# EAGLE design rekick007 (EAGLE 4.16)

## Sheet 1 of 2
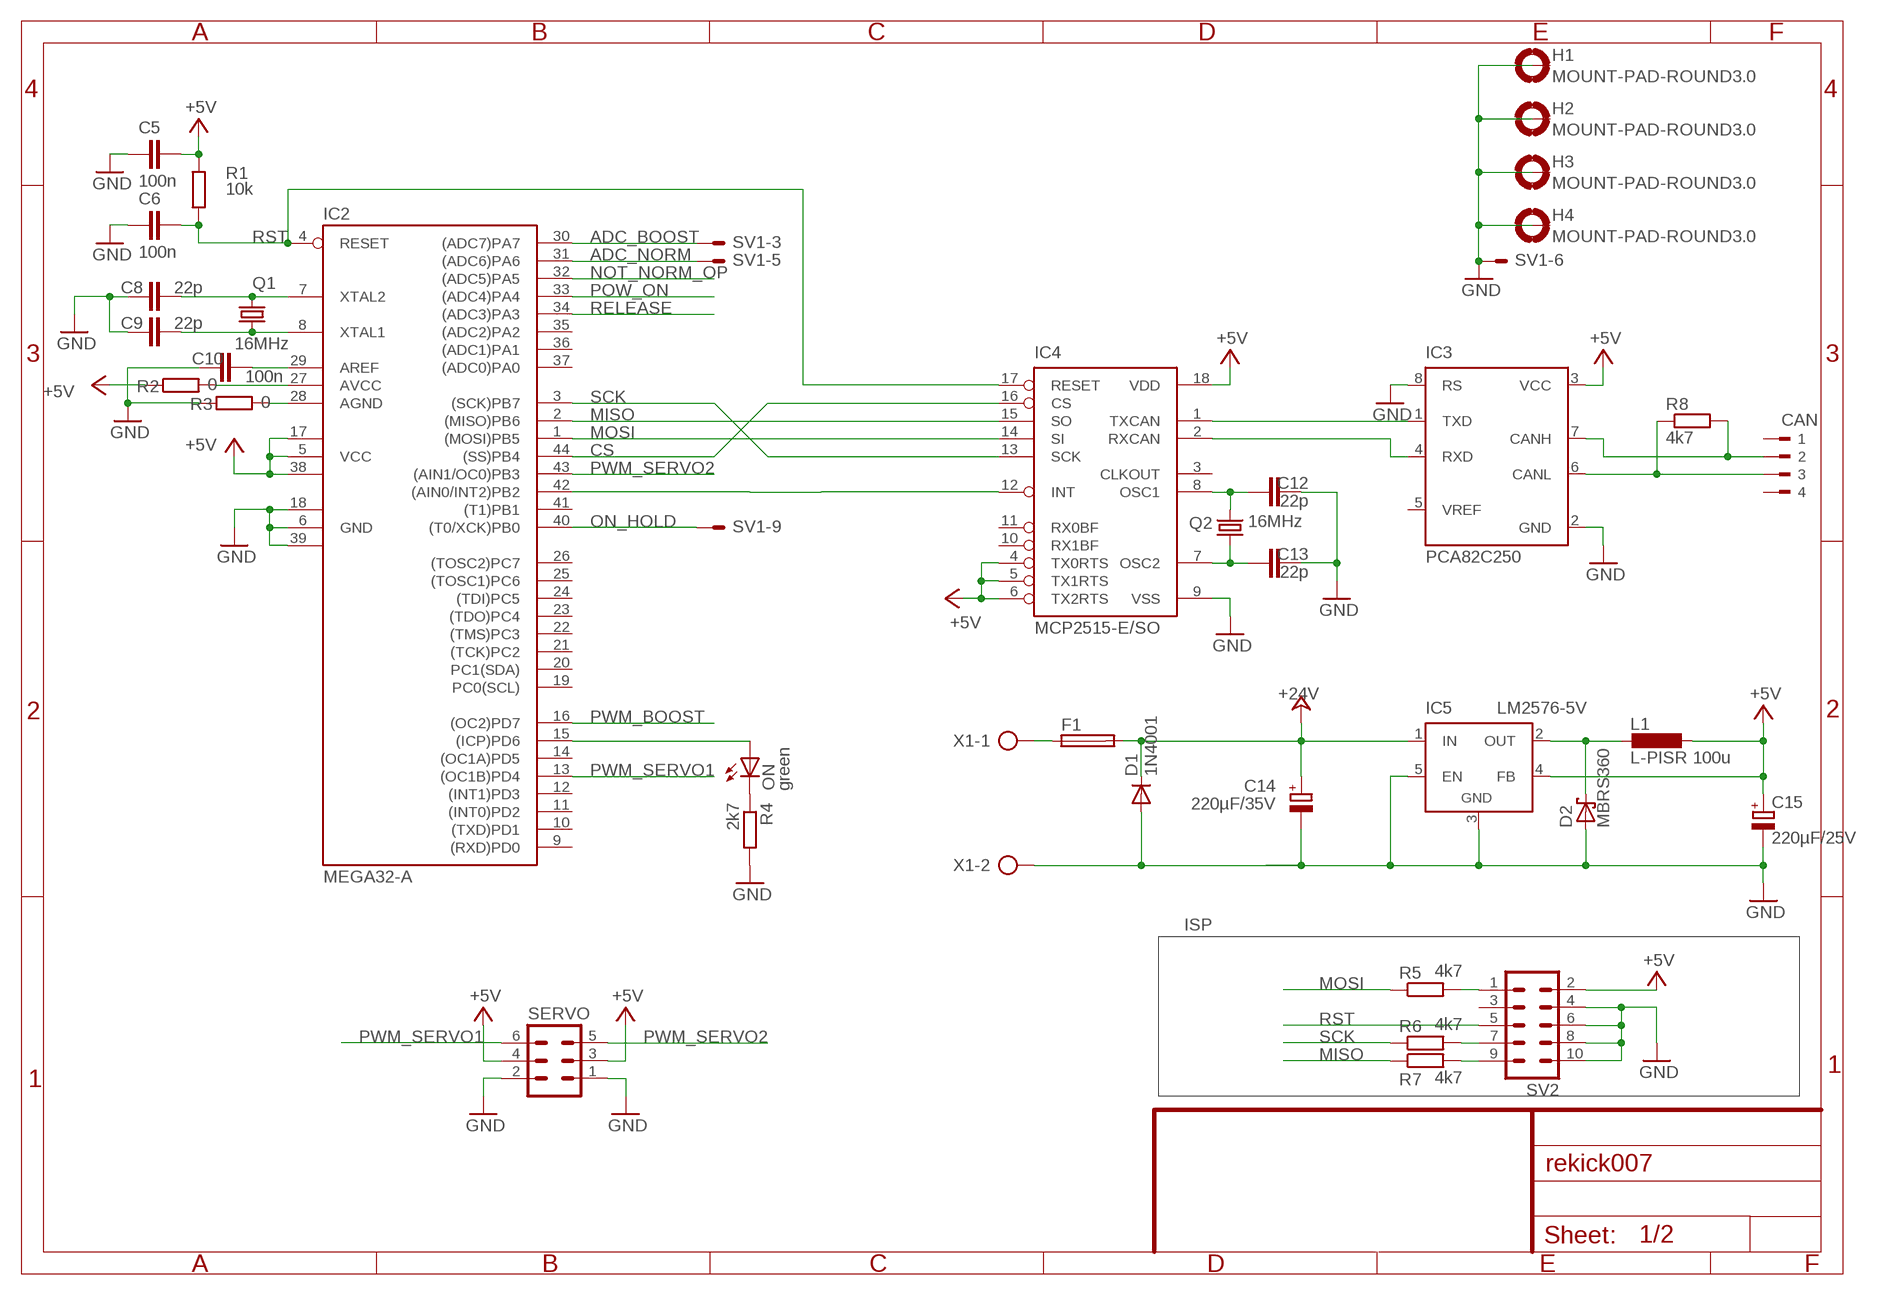
[diagram p0: schematic, sheet 1]

### Parts
C5  100n  C-EUC0603  [C0603]
C6  100n  C-EUC0603  [C0603]
C8  22p  C-EUC0603  [C0603]
C9  22p  C-EUC0603  [C0603]
C10  100n  C-EUC0603  [C0603]
C12  22p  C-EUC0603  [C0603]
C13  22p  C-EUC0603  [C0603]
C14  220µF/35V  CPOL-EUE5-10.5  [E5-10,5]
C15  220µF/25V  CPOL-EUE3.5-10  [E3,5-10]
CAN  90-4  [90-4]
D1  1N4001  1N4004  [DO41-10]
D2  MBRS360  SCHOTTKY-DIODESMD  [SMB]
F1  SH22,5A  [SH22,5A]
H1  MOUNT-PAD-ROUND3.0  [3,0-PAD]
H2  MOUNT-PAD-ROUND3.0  [3,0-PAD]
H3  MOUNT-PAD-ROUND3.0  [3,0-PAD]
H4  MOUNT-PAD-ROUND3.0  [3,0-PAD]
IC2  MEGA32-A  [TQFP44]
IC3  PCA82C250  [DIL08]
IC4  MCP2515-E/SO  [SO18L]
IC5  LM2576-5V  LM2596TV  [TO220-51]
L1  L-PISR 100u  L-EUWE-TPC  [POWER-CHOKE_WE-TPC]
ON  green  LED3MM  [LED3MM]
Q1  16MHz  CRYSTALHC49S  [HC49/S]
Q2  16MHz  CRYSTALHC49U-V  [HC49U-V]
R1  10k  R-EU_R0805  [R0805]
R2  0  R-EU_R0805  [R0805]
R3  0  R-EU_R0805  [R0805]
R4  2k7  R-EU_R0805  [R0805]
R5  4k7  R-EU_R0805  [R0805]
R6  4k7  R-EU_R0805  [R0805]
R7  4k7  R-EU_R0805  [R0805]
R8  4k7  R-EU_R0805  [R0805]
SERVO  ML6L  [ML6L]
SV1  ML10LE  [ML10L]
SV2  ML10L  [ML10L]
X1  AK500/2-H  [AK500/2-H]

### Nets
+5V [Power]: C5.2 C15.+ IC2.5(VCC) IC2.17(VCC1) IC2.38(VCC2) IC3.3(VCC) IC4.4(TX0RTS) IC4.5(TX1RTS) IC4.6(TX2RTS) IC4.18(VDD) IC5.4(FB) L1.1 R1.2 R2.1 SERVO.3 SERVO.4 SV2.2 ; also sheet 2
+24V [Power]: C14.+ D1.C F1.2 IC5.1(IN) ; also sheet 2
ADC_BOOST: IC2.30((ADC7)PA7) SV1.3
ADC_NORM: IC2.31((ADC6)PA6) SV1.5
CS: IC2.44((SS)PB4) IC4.16(CS)
GND [Power]: C5.1 C6.1 C8.1 C9.2 C10.1 C12.2 C13.2 C14.- C15.- D1.A D2.A H1.B3,0(MOUNT) H2.B3,0(MOUNT) H3.B3,0(MOUNT) H4.B3,0(MOUNT) IC2.6(GND) IC2.18(GND1) IC2.39(GND2) IC3.2(GND) IC3.8(RS) IC4.9(VSS) IC5.3(GND) IC5.5(EN) R3.1 R4.2 SERVO.1 SERVO.2 SV1.6 SV2.4 SV2.6 SV2.8 SV2.10 X1.2 ; also sheet 2
MISO: IC2.2((MISO)PB6) IC4.15(SO) R7.1
MOSI: IC2.1((MOSI)PB5) IC4.14(SI) R5.1
N$1: IC2.15((ICP)PD6) ON.A
N$2: C10.2 IC2.29(AREF)
N$3: IC2.27(AVCC) R2.2
N$4: C9.1 IC2.8(XTAL1) Q1.1
N$5: C8.2 IC2.7(XTAL2) Q1.2
N$6: R5.2 SV2.1
N$7: IC2.28(AGND) R3.2
N$8: R6.2 SV2.7
N$9: R7.2 SV2.9
N$12: IC3.1(TXD) IC4.1(TXCAN)
N$22: IC3.4(RXD) IC4.2(RXCAN)
N$24: CAN.3 IC3.6(CANL) R8.1
N$30 [Power]: D2.C IC5.2(OUT) L1.2
N$31: ON.K(C) R4.1
N$42: IC2.42((AIN0/INT2)PB2) IC4.12(INT)
N$43 [Power]: F1.1 X1.1
N$53: C13.1 IC4.7(OSC2) Q2.1
N$54: C12.1 IC4.8(OSC1) Q2.2
N$59: CAN.2 IC3.7(CANH) R8.2
NOT_NORM_OP: IC2.32((ADC5)PA5) ; also sheet 2
ON_HOLD: IC2.40((T0/XCK)PB0) SV1.9
POW_ON: IC2.33((ADC4)PA4) ; also sheet 2
PWM_BOOST: IC2.16((OC2)PD7) ; also sheet 2
PWM_SERVO1: IC2.13((OC1B)PD4) SERVO.6
PWM_SERVO2: IC2.43((AIN1/OC0)PB3) SERVO.5
RELEASE: IC2.34((ADC3)PA3) ; also sheet 2
RST: C6.2 IC2.4(RESET) IC4.17(RESET) R1.1 SV2.5
SCK: IC2.3((SCK)PB7) IC4.13(SCK) R6.1
Unconnected: CAN.1 CAN.4 IC2.9((RXD)PD0) IC2.10((TXD)PD1) IC2.11((INT0)PD2) IC2.12((INT1)PD3) IC2.14((OC1A)PD5) IC2.19(PC0(SCL)) IC2.20(PC1(SDA)) IC2.21((TCK)PC2) IC2.22((TMS)PC3) IC2.23((TDO)PC4) IC2.24((TDI)PC5) IC2.25((TOSC1)PC6) IC2.26((TOSC2)PC7) IC2.35((ADC2)PA2) IC2.36((ADC1)PA1) IC2.37((ADC0)PA0) IC2.41((T1)PB1) IC3.5(VREF) IC4.3(CLKOUT) IC4.10(RX1BF) IC4.11(RX0BF) SV1.8 SV1.10 SV2.3

### Notes on the sheet
- ISP

## Sheet 2 of 2
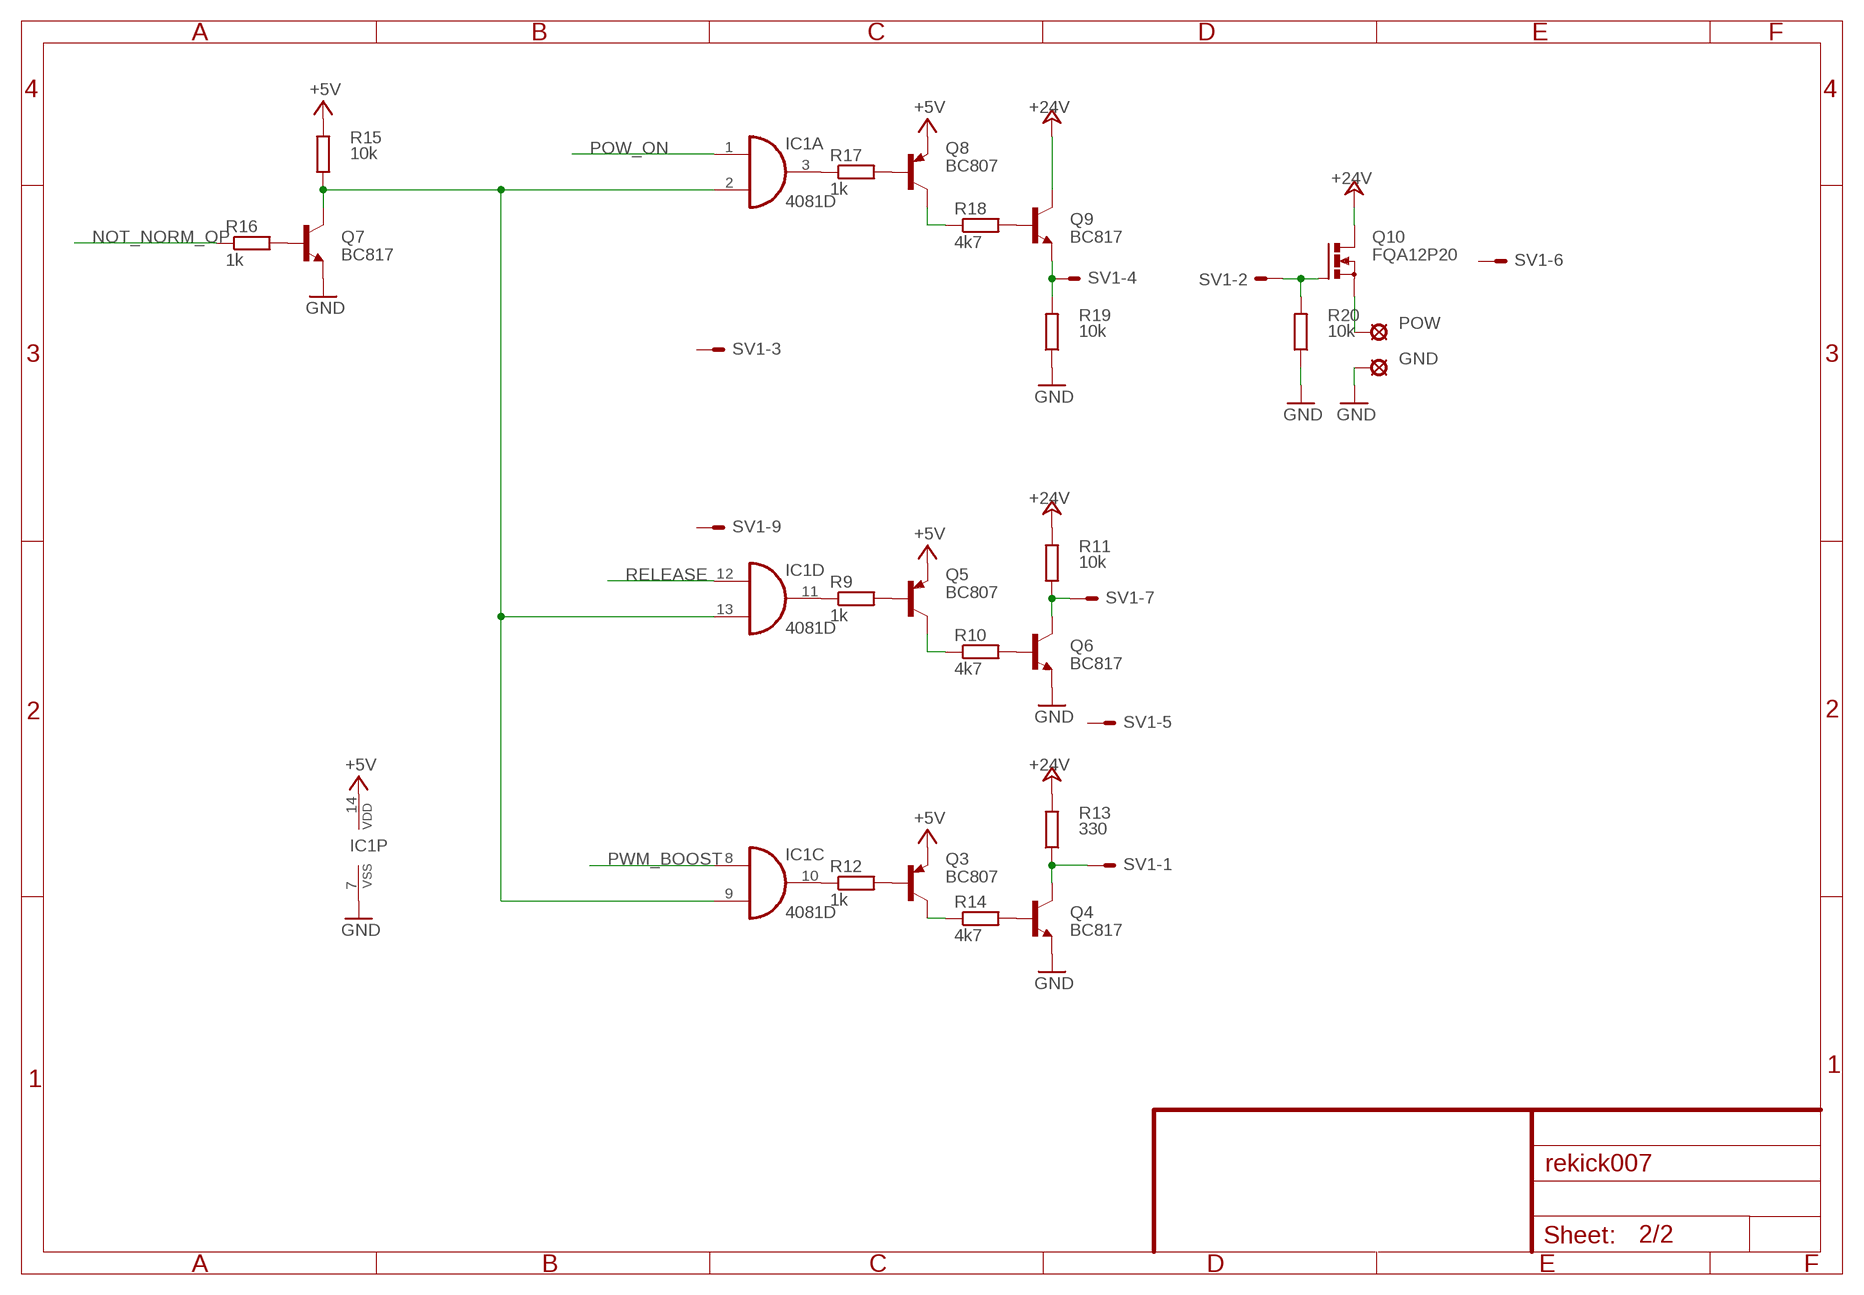
[diagram p1: schematic, sheet 2]

### Parts
GND  SE14  [SE14]
IC1  4081D  [SO14]
POW  SE14  [SE14]
Q3  BC807  BC807-40SMD  [SOT23-BEC]
Q4  BC817  BC817-25SMD  [SOT23-BEC]
Q5  BC807  BC807-40SMD  [SOT23-BEC]
Q6  BC817  BC817-25SMD  [SOT23-BEC]
Q7  BC817  BC817-25SMD  [SOT23-BEC]
Q8  BC807  BC807-40SMD  [SOT23-BEC]
Q9  BC817  BC817-25SMD  [SOT23-BEC]
Q10  FQA12P20  IRFP240  [TO247BV]
R9  1k  R-EU_R0805  [R0805]
R10  4k7  R-EU_R0805  [R0805]
R11  10k  R-EU_R0805  [R0805]
R12  1k  R-EU_R0805  [R0805]
R13  330  R-EU_R0805  [R0805]
R14  4k7  R-EU_R0805  [R0805]
R15  10k  R-EU_R0805  [R0805]
R16  1k  R-EU_R0805  [R0805]
R17  1k  R-EU_R0805  [R0805]
R18  4k7  R-EU_R0805  [R0805]
R19  10k  R-EU_R0805  [R0805]
R20  10k  R-EU_R0805  [R0805]

### Nets
+5V [Power]: IC1.14(P:VDD) Q3.E Q5.E Q8.E R15.2 ; also sheet 1
+24V [Power]: Q9.C Q10.D R11.2 R13.2 ; also sheet 1
GND [Power]: GND.MP IC1.7(P:VSS) Q4.E Q6.E Q7.E R19.1 R20.1 ; also sheet 1
N$10: Q9.E R19.2 SV1.4
N$13: Q9.B R18.2
N$14: Q4.C R13.1 SV1.1
N$21: Q3.C R14.1
N$23: Q4.B R14.2
N$25: Q3.B R12.2
N$26: Q10.G R20.2 SV1.2
N$28: Q6.B R10.2
N$29: Q6.C R11.1 SV1.7
N$32: Q5.C R10.1
N$33: Q5.B R9.2
N$34: Q7.B R16.2
N$35: IC1.11(D:O) R9.1
N$36: IC1.10(C:O) R12.1
N$38: Q8.C R18.1
N$39: Q8.B R17.2
N$40: IC1.3(A:O) R17.1
N$41: POW.MP Q10.S
NORM_OP: IC1.2(A:I1) IC1.9(C:I1) IC1.13(D:I1) Q7.C R15.1
NOT_NORM_OP: R16.1 ; also sheet 1
POW_ON: IC1.1(A:I0) ; also sheet 1
PWM_BOOST: IC1.8(C:I0) ; also sheet 1
RELEASE: IC1.12(D:I0) ; also sheet 1
Unconnected: IC1.4(B:O) IC1.5(B:I0) IC1.6(B:I1)

## Library data of the parts
C5 C6 C8-C10 C12 C13 = rcl:C-EU: CAPACITOR, European symbol
C14 C15 = rcl:CPOL-EU: POLARIZED CAPACITOR, European symbol
CAN = con-weidmueller-sl35:90-4: WEIDMUELLER CLAMP CONNECTOR
D1 = diode:1N4004: DIODE general purpose rectifier, 1 A
D2 = diode:SCHOTTKY-DIODE: Schottky Diode
F1 = fuse:SH22,5A: FUSE HOLDER grid 22,5mm, isolated cap OGN0031 8201, Schurter (Buerklin)
GND POW = solpad:SE14: SOLDER PAD E1553, drill 1,4mm, distributor Buerklin, 07F820
H1-H4 = holes:MOUNT-PAD-ROUND: MOUNTING PAD, round
IC1 = 40xx:4081: Quad 2-input AND
IC2 = atmel:MEGA32: MICROCONTROLLER 32 Kbytes FLASH 2 Kbytes SRAM 1 Kbytes EEPROM USART 8-channel 10 bit ADC Source: www.atmel.com .. doc2503.pdf
IC3 = micro-philips:PCA82C250: CAN CONTROLLER INTERFACE
IC4 = mcp2515:MCP2515
IC5 = linear:LM2596T: STEP-DOWN VOLTAGE REGULATOR
L1 = rcl:L-EU: INDUCTOR, European symbol
ON = led:LED: LED OSRAM: - CHIPLED LG R971, LG N971, LY N971, LG Q971, LY Q971, LO R971, LY R971 LH N974, LH R974 LS Q976, LO Q976, LY Q976 LO Q996 - Hyper CHIPLED LW Q18S LB Q993, LB Q99A, LB R99A - SideLED LS A670, LO A670, LY A670, LG A670, LP A670 LB A673, LV A673, LT A673, LW A673 LH A674 LY A675 LS A676, LA A676, LO A676, LY A676, LW A676 LS A679, LY A679, LG A679 - Hyper Micro SIDELED® LS Y876, LA Y876, LO Y876, LY Y876 LT Y87S - SmartLED LW L88C, LW L88S LB L89C, LB L89S, LG L890 LS L89K, LO L89K, LY L89K LS L896, LA L896, LO L896, LY L896 - TOPLED LS T670, LO T670, LY T670, LG T670, LP T670 LSG T670, LSP T670, LSY T670, LOP T670, LYG T670 LG T671, LOG T671, LSG T671 LB T673, LV T673, LT T673, LW T673 LH T674 LS T676, LA T676, LO T676, LY T676, LB T676, LH T676, LSB T676, LW T676 LB T67C, LV T67C, LT T67C, LS T67K, LO T67K, LY T67K, LW E67C LS E67B, LA E67B, LO E67B, LY E67B, LB E67C, LV E67C, LT E67C LW T67C LS T679, LY T679, LG T679 LS T770, LO T770, LY T770, LG T770, LP T770 LB T773, LV T773, LT T773, LW T773 LH T774 LS E675, LA E675, LY E675, LS T675 LS T776, LA T776, LO T776, LY T776, LB T776 LHGB T686 LT T68C, LB T68C - Hyper Mini TOPLED® LB M676 - Mini TOPLED Santana® LG M470 LS M47K, LO M47K, LY M47K Source: http://www.osram.convergy.de - LUMILED® LXK2-PW12-R00, LXK2-PW12-S00, LXK2-PW14-U00, LXK2-PW14-V00 LXK2-PM12-R00, LXK2-PM12-S00, LXK2-PM14-U00 LXK2-PE12-Q00, LXK2-PE12-R00, LXK2-PE12-S00, LXK2-PE14-T00, LXK2-PE14-U00 LXK2-PB12-K00, LXK2-PB12-L00, LXK2-PB12-M00, LXK2-PB14-N00, LXK2-PB14-P00, LXK2-PB14-Q00 LXK2-PR12-L00, LXK2-PR12-M00, LXK2-PR14-Q00, LXK2-PR14-R00 LXK2-PD12-Q00, LXK2-PD12-R00, LXK2-PD12-S00 LXK2-PH12-R00, LXK2-PH12-S00 LXK2-PL12-P00, LXK2-PL12-Q00, LXK2-PL12-R00 Source: www.luxeon.com
Q1 Q2 = crystal:CRYSTAL: CRYSTAL
Q3 Q5 Q8 = transistor-pnp:BC807*: PNP Transistror
Q4 Q6 Q7 Q9 = transistor-npn:BC817*: NPN Transistor
Q10 = transistor-power:IRFP240: HEXFET Power MosFet Source: http://www.irf.com/
R1-R20 = rcl:R-EU_: RESISTOR, European symbol
SERVO = con-harting-ml:ML6: HARTING
SV1 = con-harting-ml:ML10?E: HARTING
SV2 = con-harting-ml:ML10: HARTING
X1 = con-ptr500:AK500/2-H: CONNECTOR Aug. 2004 / PTR Meßtechnik: Die Bezeichnung der Serie AK505 wurde geändert. Es handelt sich hierbei um AK500 in horizontaler Ausführung.

## Net classes
1 Power: width 0.406 mm
2 High Power: width 2 mm

## Board
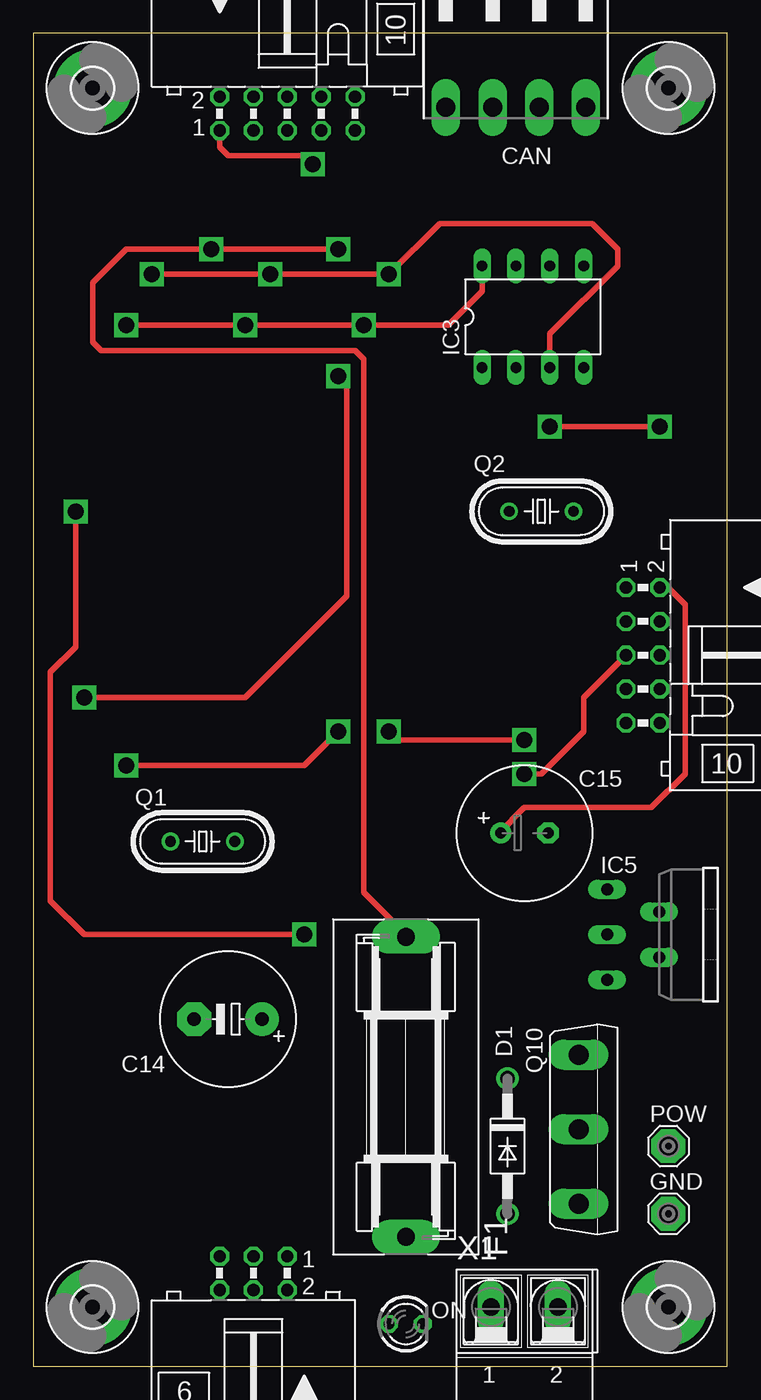
[diagram p2: board, top side]
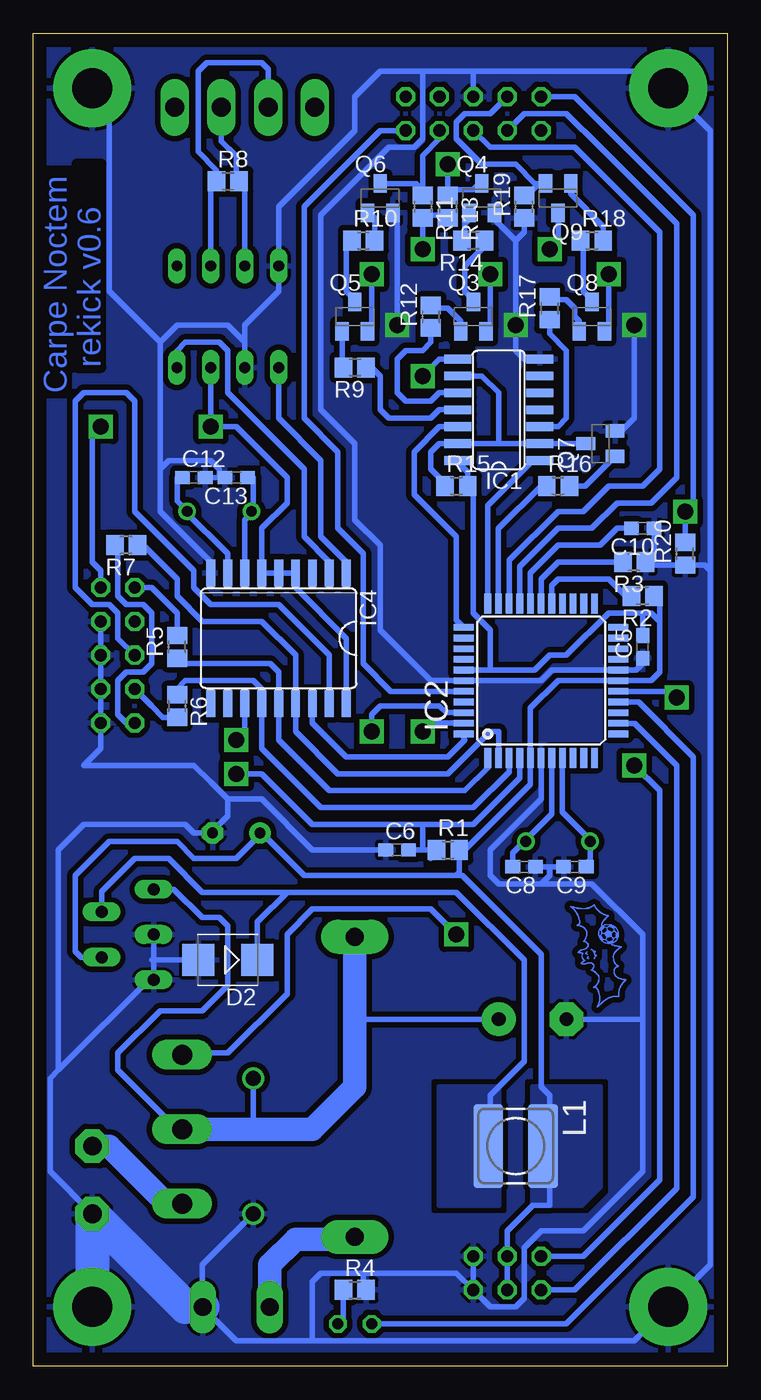
[diagram p3: board, bottom side, seen from below]

Size 52.05 x 100 mm. Coordinates in mm from the lower left corner, seen from the top.
Outline: 0,0 52.05,0 52.05,100 0,100 0,0
Copper layers (1*16): Top 0.035mm / dielectric 1.5mm / Bottom 0.035mm
Design rules "olimex_10mils": minimum track width 10mil, minimum drill 24mil, track to track 10mil, track to pad 10mil, pad to pad 10mil, via to via 10mil, smd to smd 10mil, copper to edge 40mil, drill to drill 10mil, minimum pad ring 10mil, minimum via ring 8mil, stop-mask expansion 0mil, vias tented up to drill 0mil, thermal gap 10mil

### Footprints (pad centres in the part's own frame; a part is rotated, then mirrored left to right if it is on the bottom)
C0603 = smd 1.1 x 1: 1 -0.85,0; 2 0.85,0
E5-10,5 = drill 1.016 pad 2.54 round: + -2.54,0 | drill 1.016 pad 2.54 octagon: - 2.54,0
E3,5-10 = drill 0.813 pad 1.6 round: + -1.778,0 | drill 0.813 pad 1.6 octagon: - 1.778,0
90-4 = drill 1.422 long: 1 -5.25,5.25; 2 -1.75,5.25; 3 1.75,5.25; 4 5.25,5.25
DO41-10 = drill 1.118 round: A 5.08,0; C -5.08,0
SMB = smd 2.4 x 2.4: A 2.2,0; C -2.2,0
SH22,5A = drill 1.321 pad 2.54 long: 1 -11.252,0; 2 11.252,0
SE14 = drill 1.397 pad 2.54 octagon: MP 0,0
3,0-PAD = drill 3 pad 5.842 round: B3,0 0,0
SO14 = smd 0.66 x 2.032: 1 -3.81,-3.073; 2 -2.54,-3.073; 3 -1.27,-3.073; 4 0,-3.073; 5 1.27,-3.073; 6 2.54,-3.073; 7 3.81,-3.073; 8 3.81,3.073; 9 2.54,3.073; 10 1.27,3.073; 11 0,3.073; 12 -1.27,3.073; 13 -2.54,3.073; 14 -3.81,3.073
TQFP44 = smd 1.5 x 0.5: 1 -5.8,4; 2 -5.8,3.2; 3 -5.8,2.4; 4 -5.8,1.6; 5 -5.8,0.8; 6 -5.8,0; 7 -5.8,-0.8; 8 -5.8,-1.6; 9 -5.8,-2.4; 10 -5.8,-3.2; 11 -5.8,-4; 23 5.8,-4; 24 5.8,-3.2; 25 5.8,-2.4; 26 5.8,-1.6; 27 5.8,-0.8; 28 5.8,0; 29 5.8,0.8; 30 5.8,1.6; 31 5.8,2.4; 32 5.8,3.2; 33 5.8,4 | smd 0.5 x 1.5: 12 -4,-5.8; 13 -3.2,-5.8; 14 -2.4,-5.8; 15 -1.6,-5.8; 16 -0.8,-5.8; 17 0,-5.8; 18 0.8,-5.8; 19 1.6,-5.8; 20 2.4,-5.8; 21 3.2,-5.8; 22 4,-5.8; 34 4,5.8; 35 3.2,5.8; 36 2.4,5.8; 37 1.6,5.8; 38 0.8,5.8; 39 0,5.8; 40 -0.8,5.8; 41 -1.6,5.8; 42 -2.4,5.8; 43 -3.2,5.8; 44 -4,5.8
DIL08 = drill 0.813 long: 1 -3.81,-3.81; 2 -1.27,-3.81; 3 1.27,-3.81; 4 3.81,-3.81; 5 3.81,3.81; 6 1.27,3.81; 7 -1.27,3.81; 8 -3.81,3.81
SO18L = smd 0.66 x 2.032: 1 -5.08,-4.902; 2 -3.81,-4.902; 3 -2.54,-4.902; 4 -1.27,-4.902; 5 0,-4.902; 6 1.27,-4.902; 7 2.54,-4.902; 8 3.81,-4.902; 9 5.08,-4.902; 10 5.08,4.902; 11 3.81,4.902; 12 2.54,4.902; 13 1.27,4.902; 14 0,4.902; 15 -1.27,4.902; 16 -2.54,4.902; 17 -3.81,4.902; 18 -5.08,4.902
TO220-51 = drill 0.9 long: 1 -3.4,-8.4; 2 -1.7,-4.5; 3 0,-8.4; 4 1.7,-4.5; 5 3.4,-8.4
POWER-CHOKE_WE-TPC = smd 6.3 x 2.2: 1 0,2.05; 2 0,-2.05
LED3MM = drill 0.813 octagon: A -1.27,0; K 1.27,0
HC49/S = drill 0.813 round: 1 -2.413,0; 2 2.413,0
HC49U-V = drill 0.813 round: 1 -2.413,0; 2 2.413,0
SOT23-BEC = smd 1 x 1.4: B -0.95,-1.1; C 0,1.1; E 0.95,-1.1
TO247BV = drill 1.499 long: D 0,-2.921; G -5.588,-2.921; S 5.588,-2.921
R0805 = smd 1.3 x 1.5: 1 -0.85,0; 2 0.85,0
ML6L = drill 0.914 octagon: 1 -2.54,-1.27; 2 -2.54,1.27; 3 0,-1.27; 4 0,1.27; 5 2.54,-1.27; 6 2.54,1.27
ML10L = drill 0.914 octagon: 1 -5.08,-1.27; 2 -5.08,1.27; 3 -2.54,-1.27; 4 -2.54,1.27; 5 0,-1.27; 6 0,1.27; 7 2.54,-1.27; 8 2.54,1.27; 9 5.08,-1.27; 10 5.08,1.27
AK500/2-H = drill 1.321 long: 1 -2.515,0; 2 2.515,0

### Placement (x,y rotation side)
C5  6.35,53.98 90 bottom
C6  24.77,38.73 0 bottom
C8  15.24,37.47 180 bottom
C9  11.43,37.47 180 bottom
C10  6.35,62.87 180 bottom
C12  40.01,66.67 0 bottom
C13  36.83,66.67 180 bottom
C14  14.61,26.04 180 top
C15  36.83,40.01 0 top
CAN  36.2,99.69 180 top
D1  35.56,16.51 270 top
D2  37.47,30.48 180 bottom
F1  27.94,20.95 90 top
GND  47.62,11.43 0 top
H1  4.45,95.89 0 top
H2  4.45,4.45 0 top
H3  47.62,95.89 0 top
H4  47.62,4.45 0 top
IC1  17.14,71.75 90 bottom
IC2  13.97,51.44 90 bottom
IC3  37.47,78.74 0 top
IC4  33.66,54.61 180 bottom
IC5  51.44,32.38 270 top
L1  15.88,16.51 270 bottom
ON  27.94,3.17 0 top
POW  47.62,16.51 0 top
Q1  12.7,39.37 0 top
Q2  38.1,64.14 0 top
Q3  19.05,78.74 0 bottom
Q4  18.41,87.63 0 bottom
Q5  27.94,78.74 0 bottom
Q6  26.04,87.63 0 bottom
Q7  9.53,69.22 90 bottom
Q8  10.16,78.74 0 bottom
Q9  12.7,87.63 180 bottom
Q10  43.81,17.78 270 top
R1  20.95,38.73 0 bottom
R2  6.35,57.78 180 bottom
R3  6.99,60.33 180 bottom
R4  27.94,5.71 0 bottom
R5  41.27,53.98 90 bottom
R6  41.27,49.53 270 bottom
R7  45.09,61.59 180 bottom
R8  37.47,88.9 0 bottom
R9  27.94,74.93 180 bottom
R10  27.3,84.45 0 bottom
R11  22.86,87 270 bottom
R12  22.23,78.74 90 bottom
R13  20.95,87 270 bottom
R14  19.05,84.45 180 bottom
R15  20.32,66.04 0 bottom
R16  12.7,66.04 0 bottom
R17  13.34,79.38 90 bottom
R18  10.16,84.45 0 bottom
R19  15.24,87 90 bottom
R20  3.17,60.96 90 bottom
SERVO  16.51,6.99 180 top
SV1  19.05,93.98 0 top
SV2  45.72,53.34 270 top
U$1  [CN-LOGO-WIRE]  9.53,31.11 90 bottom
X1  36.83,4.45 0 top

### Tracks (layer width: path | path; a pad name or v marks a point on that pad's centre or on a via)
+5V  (via drill 1.2 pad 1.78)
  Top 0.406: v8.89,81.92 v17.78,81.92 v26.67,81.92 30.48,85.72 41.91,85.72 43.81,83.82 43.81,82.55 38.73,77.47 IC3.3 | v46.99,70.48 v38.73,70.48 | SV2.2 47.62,58.42 48.9,57.15 48.9,44.45 46.35,41.91 36.83,41.91 34.92,40.01 C15.+
  Bottom 0.406: 8.26,51.44 12.7,51.44 14.77,49.37 IC2.5 14.77,43.65 19.68,38.73 R1.2 | 17.78,52.23 14.44,52.23 13.34,53.34 12.06,53.34 8.89,56.52 6.35,56.52 | 17.78,52.23 IC2.38 | 8.26,51.44 IC2.17 | IC4.18 28.57,54.61 32.38,58.42 IC4.4 32.38,59.69 32.56,59.51 IC4.5 33.66,59.69 33.83,59.51 IC4.6 34.92,62.87 33.02,64.77 33.02,66.67 36.83,70.48 v38.73,70.48 IC3.3 | 17.78,52.23 17.78,55.24 19.05,56.52 19.05,66.04 R15.2 19.47,67.09 20.32,67.94 IC1.14 | 8.26,51.44 5.71,51.44 5.08,52.07 5.08,55.88 | 5.08,55.88 5.71,56.52 6.35,56.52 | 13.34,16.51 L1.1 | 13.34,16.51 13.34,20.32 13.97,20.95 13.97,30.91 19.89,36.83 20.32,36.83 | 6.35,56.52 C5.2 | 13.34,16.51 13.34,12.06 14.61,12.06 16.51,10.16 SERVO.3 SERVO.4 | R2.1 5.08,57.37 5.08,55.88 | 26.67,81.77 v26.67,81.92 26.67,77.96 Q5.E | 17.78,81.77 v17.78,81.92 17.78,77.96 Q3.E | v8.89,81.92 8.89,78.11 9.36,77.64 | 9.36,77.64 9.53,77.47 | 9.36,77.64 Q8.E | v46.99,70.48 47.62,69.85 47.62,60.33 46.99,59.69 SV2.2 | R1.2 20.32,38.73 | R1.2 20.11,37.05 20.32,36.83 | 20.32,36.83 31.75,36.83 34.92,40.01 | IC5.4 48.47,30.68 48.9,31.11 48.9,36.83 46.35,39.37 41.27,39.37 40.01,38.1 36.83,38.1 34.92,40.01 | 34.92,40.01 C15.+
  pour Bottom (isolate 1.016, no thermals): 14.61,12.06 14.61,20.95 9.53,20.95 9.53,12.06
+24V  (via drill 1.2 pad 1.78)
  Top 0.406: F1.2 27.94,32.38 24.77,35.56 24.77,75.56 24.13,76.2 5.08,76.2 4.45,76.83 4.45,81.28 6.99,83.82 v13.34,83.82 v22.86,83.82
  Bottom 0.406: C14.+ 27.94,26.04 | 35.56,17.78 D1.C | IC5.1 41.5,35.78 39.37,33.66 38.1,33.66 37.47,33.02 37.47,28.57 39.37,26.67 42.55,26.67 45.72,23.5 45.72,22.23 41.27,17.78 | R13.2 21.17,86.36 22.86,86.36 R11.2 v22.86,83.82 | Q9.C 12.7,84.45 v13.34,83.82
  Bottom 1.778: 27.94,32.38 F1.2 27.94,26.04 27.94,20.95 31.11,17.78 35.56,17.78 Q10.D 41.27,17.78
ADC_BOOST
  Bottom 0.406: IC2.30 15.57,59.99 12.7,62.87 10.16,62.87 8.26,64.77 5.71,64.77 3.81,66.67 3.81,85.72 9.53,91.44 12.06,93.98 15.24,93.98 SV1.3
ADC_NORM
  Bottom 0.406: IC2.31 16.37,60.47 12.7,64.14 10.79,64.14 8.89,66.04 6.35,66.04 5.08,67.31 5.08,85.09 11.43,91.44 17.78,91.44 SV1.5
CS
  Bottom 0.406: IC4.16 31.11,48.26 28.57,45.72 20.95,45.72 19.68,46.99 19.77,47.08 IC2.44
GND  (via drill 1.2 pad 1.78)
  Top 0.406: v6.99,78.11 v15.88,78.11 v24.77,78.11 31.11,78.11 33.66,80.64 IC3.8
  Bottom 0.406: 19.68,51.44 13.97,51.44 13.17,52.23 IC2.18 6.82,52.23 6.35,52.7 C5.1 | 19.68,51.44 IC2.39 | 12.06,37.47 C9.2 13.34,37.47 | 13.34,37.47 C8.1 | IC2.6 13.97,42.55 17.78,38.73 17.78,36.83 17.14,36.2 13.97,36.2 | 13.34,37.47 13.34,36.83 13.97,36.2 | 38.1,66.67 C12.2 | IC4.9 38.73,60.33 42.55,64.14 42.55,67.31 | 42.55,67.31 41.91,67.94 38.73,67.94 38.1,67.31 38.1,66.67 | 38.1,66.67 C13.2 | 22.86,97.16 26.04,97.16 27.94,95.25 27.94,92.71 33.66,87 IC3.8 33.66,80.64 36.2,78.11 36.2,76.83 | R4.2 27.09,5.29 | R4.2 26.67,5.71 27.3,6.35 27.3,6.99 | 19.05,97.16 5.71,97.16 H1.B3,0 1.27,92.71 1.27,59.69 | 19.05,97.16 22.86,97.16 | 31.11,1.91 6.99,1.91 H2.B3,0 1.27,7.62 1.27,59.69 | 31.11,1.91 36.83,1.91 39.37,4.45 | 6.35,26.04 6.35,14.61 10.79,10.16 13.97,10.16 15.24,8.89 15.24,5.08 15.88,4.45 17.78,4.45 SERVO.2 | 6.35,26.04 6.35,32.38 10.16,36.2 13.97,36.2 | 19.05,97.16 SV1.6 | R4.2 27.3,5.71 | SV2.4 SV2.6 SV2.8 SV2.10 46.99,46.35 48.26,45.09 40.01,45.09 38.73,43.81 | 6.35,26.04 C14.- | SERVO.2 20.32,6.99 27.3,6.99 | SERVO.2 SERVO.1 | GND.MP 50.8,14.61 50.8,21.59 50.16,22.23 | 39.37,4.45 X1.2 | D1.A 39.37,7.62 39.37,4.45 | C10.1 5.71,62.87 5.5,62.65 5.5,60.54 5.71,60.33 R3.1 6.35,60.33 6.13,60.11 R20.1 1.69,60.11 1.27,59.69 | 13.97,75.56 IC1.7 15.24,75.56 15.88,76.2 v15.88,78.11 15.88,84.45 | Q6.E 24.77,86.21 v24.77,78.11 | Q7.E 8.43,70.02 8.26,69.85 6.99,71.12 v6.99,78.11 | 19.68,51.44 22.23,51.44 26.04,55.24 26.04,61.59 27.94,63.5 27.94,69.22 30.48,71.75 30.48,86.36 25.4,91.44 23.5,91.44 22.86,92.08 22.86,97.16 | 42.55,76.83 42.55,67.31 | 42.55,76.83 41.27,78.11 37.47,78.11 36.2,76.83 | 36.2,76.83 IC3.2
  Bottom 0.406: 42.55,76.83 46.35,80.64 46.35,94.61 H3.B3,0 | C6.1 31.11,38.73 34.92,42.55 37.47,42.55 | 27.3,6.99 30.48,6.99 31.11,6.35 31.11,1.91 | 37.47,42.55 38.73,43.81 | 38.73,43.81 38.61,43.69 | IC5.3 43.18,32.38 43.03,32.24 43.03,30.48 | 43.03,30.48 IC5.5 43.03,29.07 43.18,29.21 50.16,22.23 | 43.03,30.48 43.18,30.48 | 43.03,30.48 D2.A | 38.73,40.01 40.01,40.01 40.64,40.64 48.26,40.64 50.16,38.73 50.16,22.23 | 38.73,40.01 C15.- | 37.47,42.55 37.47,41.27 38.73,40.01 | Q4.E 17.61,86.53 17.78,86.36 15.88,84.45 | R19.1 15.24,85.09 15.88,84.45
  Bottom 2.54: 39.37,4.45 40.64,4.45 GND.MP H4.B3,0
  pour Bottom (isolate 0.406, rank 3): 0,100.33 52.07,100.33 52.07,0 0,0
MISO
  Bottom 0.406: IC2.2 17.14,45.66 17.14,47.62 17.78,47.62 20.95,44.45 29.21,44.45 32.38,47.62 IC4.15 32.38,53.34 34.92,55.88 39.37,55.88 41.27,57.78 41.27,59.05 43.81,61.59 | 43.81,61.59 R7.1 43.81,61.59
MOSI
  Bottom 0.406: IC2.1 17.97,44.9 19.68,43.18 29.84,43.18 33.66,46.99 IC4.14 33.66,52.07 34.29,52.7 41.27,52.7 R5.1
N$1
  Bottom 0.406: IC2.15 6.66,49.84 2.54,45.72 2.54,12.7 12.06,3.17 ON.A
N$2
  Bottom 0.406: IC2.29 14.77,59.52 12.7,61.59 9.53,61.59 8.26,62.87 7.62,62.87 C10.2
N$3
  Bottom 0.406: IC2.27 13.17,58.59 12.7,59.05 8.89,59.05 7.62,57.78 R2.2
N$4
  Bottom 0.406: C9.1 10.79,37.47 10.29,37.97 Q1.1 10.16,39.37 12.37,41.58 IC2.8
N$5
  Bottom 0.406: IC2.7 13.17,41.44 15.24,39.37 | Q1.2 15.24,39.37 | C8.2 16.09,38.52 15.24,39.37
N$6
  Bottom 0.406: R5.2 41.27,56.52 43.18,58.42 SV2.1
N$7
  Bottom 0.406: IC2.28 13.97,59.05 12.7,60.33 R3.2
N$8
  Bottom 0.406: R6.2 42.33,48.68 43.18,49.53 SV2.7
N$9
  Bottom 0.406: SV2.9 45.09,48.26 45.72,48.9 45.72,51.44 45.09,52.07 43.81,52.07 43.18,52.7 43.18,56.52 43.81,57.15 45.09,57.15 45.72,57.78 45.72,59.05 45.72,60.33 45.72,61.59 R7.2
N$10
  Bottom 0.406: R19.2 15.24,87.63 14.14,88.73 | Q9.E 14.14,88.73 | 14.14,88.73 14.44,88.73 15.88,90.17 18.41,90.17 20.32,92.08 20.32,93.34 19.68,93.98 17.78,93.98 SV1.4
N$12
  Bottom 0.406: IC4.1 28.57,60.33 30.48,62.23 30.48,67.94 33.66,71.12 IC3.1
N$13
  Bottom 0.406: R18.2 9.31,85.51 11.75,87.95 Q9.B
N$14  (via drill 1.2 pad 1.78)
  Top 0.406: SV1.1 13.97,91.44 14.61,90.81 20.95,90.81 v20.95,90.17
  Bottom 0.406: Q4.C 18.41,88.9 19.05,88.27 20.95,88.27 | v20.95,90.17 20.95,88.27 | 20.95,88.27 R13.1
N$21
  Bottom 0.406: Q3.C 19.05,80.01 19.68,80.64 19.68,82.55 18.41,83.82 18.41,84.45 R14.1
N$22
  Bottom 0.406: IC4.2 29.84,60.33 31.75,62.23 31.75,67.31 34.92,70.48 37.47,73.03 37.47,76.2 38.1,76.83 40.64,76.83 41.27,76.2 IC3.4
N$23
  Bottom 0.406: Q4.B 19.36,86.05 19.68,85.72 19.68,84.45 R14.2
N$24
  Bottom 0.406: CAN.3 34.45,97.31 34.92,97.79 39.05,97.79 39.69,97.16 39.69,91.12 38.31,89.75 R8.1 38.73,88.9 IC3.6
N$25
  Bottom 0.406: Q3.B 20,78.42 20.95,79.38 22.23,79.38 R12.2
N$26  (via drill 1.2 pad 1.78)
  Top 0.406: v3.17,64.14 3.17,53.98 1.27,52.07 1.27,34.92 3.81,32.38 v20.32,32.38
  Bottom 0.406: v20.32,32.38 22.23,34.29 31.11,34.29 33.02,32.38 33.02,27.94 37.47,23.5 40.64,23.5 40.77,23.37 Q10.G | SV1.2 11.43,95.25 2.54,86.36 2.54,64.77 v3.17,64.14 R20.2
N$28
  Bottom 0.406: Q6.B 26.84,86.53 26.67,86.36 26.45,86.14 R10.2
N$29
  Bottom 0.406: SV1.7 21.59,92.08 22.86,90.81 22.86,88.27 | R11.1 22.86,88.27 | Q6.C 23.32,88.73 22.86,88.27
N$30
  Bottom 0.406: 33.02,35.56 20.32,35.56 15.24,30.48 15.24,22.86 17.78,20.32 17.78,16.51 L1.2 | IC5.2 46.94,35.62 44.45,38.1 41.91,38.1 39.37,35.56 33.02,35.56 | D2.C 35.27,33.31 33.02,35.56
  pour Bottom (isolate 1.016, no thermals): 17.14,12.06 17.14,20.95 21.59,20.95 21.59,12.06
N$31
  Bottom 0.406: R4.1 28.79,3.6 ON.K
N$32
  Bottom 0.406: Q5.C 27.94,80.01 28.57,80.64 28.57,84.45 R10.1
N$33
  Bottom 0.406: R9.2 29.21,74.93 28.89,75.25 Q5.B
N$34
  Bottom 0.406: R16.2 12.06,66.04 10.65,66.04 Q7.B
N$35
  Bottom 0.406: IC1.11 21.59,71.75 22.23,71.12 25.4,71.12 26.04,71.75 26.04,74.3 26.67,74.93 R9.1
N$36
  Bottom 0.406: IC1.10 21.59,73.03 22.23,72.39 24.13,72.39 24.77,73.03 24.77,75.56 24.13,76.2 22.86,76.2 22.23,76.83 22.23,77.47 R12.1
N$38
  Bottom 0.406: Q8.C 10.16,80.01 10.79,80.64 10.79,83.82 11.43,84.45 R18.1
N$39
  Bottom 0.406: Q8.B 11.11,78.42 11.43,78.74 11.43,79.38 12.06,80.01 13.34,80.01 R17.2
N$40
  Bottom 0.406: R17.1 13.34,77.47 12.06,76.2 12.06,71.12 12.7,70.48 13.97,70.48 IC1.3
N$41
  Bottom 1.778: 46.99,16.51 POW.MP 46.35,16.51 42.04,12.19 Q10.S
N$42  (via drill 1.2 pad 1.78)
  Top 0.406: v36.83,46.99 27.3,46.99 v26.67,47.62
  Bottom 0.406: IC2.42 21.09,49.03 21.59,49.53 26.04,49.53 26.67,48.9 v26.67,47.62 | IC4.12 36.2,47.62 v36.83,46.99
N$43
  Bottom 1.778: X1.1 34.31,7.59 32.38,9.53 27.94,9.53 F1.1
N$53
  Bottom 0.406: IC4.7 36.2,63.5 35.56,64.14 Q2.1 35.56,64.26 35.56,66.67 C13.1
N$54
  Bottom 0.406: IC4.8 37.47,60.96 40.64,64.14 Q2.2 41.27,64.9 41.27,66.67 C12.1
N$59
  Bottom 0.406: CAN.2 37.95,91.92 36.83,90.81 36.83,88.9 R8.2 36.2,88.9 IC3.7
NORM_OP
  Bottom 0.406: 17.14,69.22 15.88,69.22 IC1.2 | 21.59,66.04 R15.1 20.95,66.04 22.23,67.31 22.23,68.58 21.59,69.22 20.32,69.22 | IC1.9 20.32,74.3 18.41,74.3 17.14,73.03 17.14,69.22 | IC1.13 20.32,69.22 | 17.14,69.22 IC1.13 | IC1.13 20.32,69.22 | IC1.13 20.32,69.22 | 13.97,69.22 IC1.2 | 13.97,69.22 IC1.2 | Q7.C 13.97,69.22
NOT_NORM_OP
  Bottom 0.406: R16.1 13.97,66.04 17.17,62.84 IC2.32
ON_HOLD
  Bottom 0.406: IC2.40 25.23,50.63 27.3,52.7 27.3,60.96 29.21,62.87 29.21,68.58 31.75,71.12 31.75,87 26.04,92.71 SV1.9
POW_ON
  Bottom 0.406: IC2.33 17.97,64.58 14.61,67.94 | 14.61,67.94 IC1.1 | IC1.1 13.97,67.94 | 14.61,67.94 IC1.1
PWM_BOOST  (via drill 1.2 pad 1.78)
  Top 0.406: v3.81,50.16 15.88,50.16 23.5,57.78 23.5,73.66 v22.86,74.3
  Bottom 0.406: v22.86,74.3 21.59,75.56 20.32,75.56 IC1.8 | IC2.16 4.28,50.63 v3.81,50.16
PWM_SERVO1
  Bottom 0.406: IC2.13 6.96,48.23 6.35,47.62 3.81,45.09 3.81,13.34 11.43,5.71 SERVO.6
PWM_SERVO2  (via drill 1.2 pad 1.78)
  Top 0.406: v6.99,45.09 20.32,45.09 v22.86,47.62
  Bottom 0.406: IC2.43 19.71,48.23 19.68,48.26 22.23,48.26 v22.86,47.62 | SERVO.5 10.79,8.26 5.08,13.97 5.08,43.18 v6.99,45.09
RELEASE
  Bottom 0.406: IC2.34 20.32,55.98 20.32,62.23 23.5,65.41 23.5,68.58 21.59,70.48 20.32,70.48 IC1.12
RST  (via drill 1.2)
  Top 0.406: v36.83,44.45 38.1,44.45 41.27,47.62 41.27,50.16 SV2.5
  Bottom 0.406: IC2.4 15.57,44.12 19.05,40.64 22.86,40.64 | 29.84,49.53 IC4.17 29.84,53.34 33.66,57.15 38.73,57.15 40.01,58.42 40.01,59.69 44.45,64.14 44.45,72.39 45.09,73.03 48.26,73.03 48.9,72.39 48.9,58.42 48.26,57.78 47.62,57.15 46.35,57.15 45.72,56.52 45.72,54.61 SV2.5 | 22.23,38.1 R1.1 22.23,38.73 22.86,38.73 | v36.83,44.45 34.92,44.45 31.11,40.64 22.86,40.64 | 22.86,38.73 C6.2 | 22.86,40.64 22.86,38.73
SCK
  Bottom 0.406: IC2.3 16.37,44.59 19.05,41.91 30.48,41.91 34.92,46.35 IC4.13 34.92,50.8 35.56,51.44 40.64,51.44 41.27,50.8 R6.1

### Text on the board
Bottom: rekick v0.6 | Carpe Noctem